# Altium schematic sheet EsquematicoCaneca.SchDoc
size A4; SheetNumber: 1; SheetTotal: 1
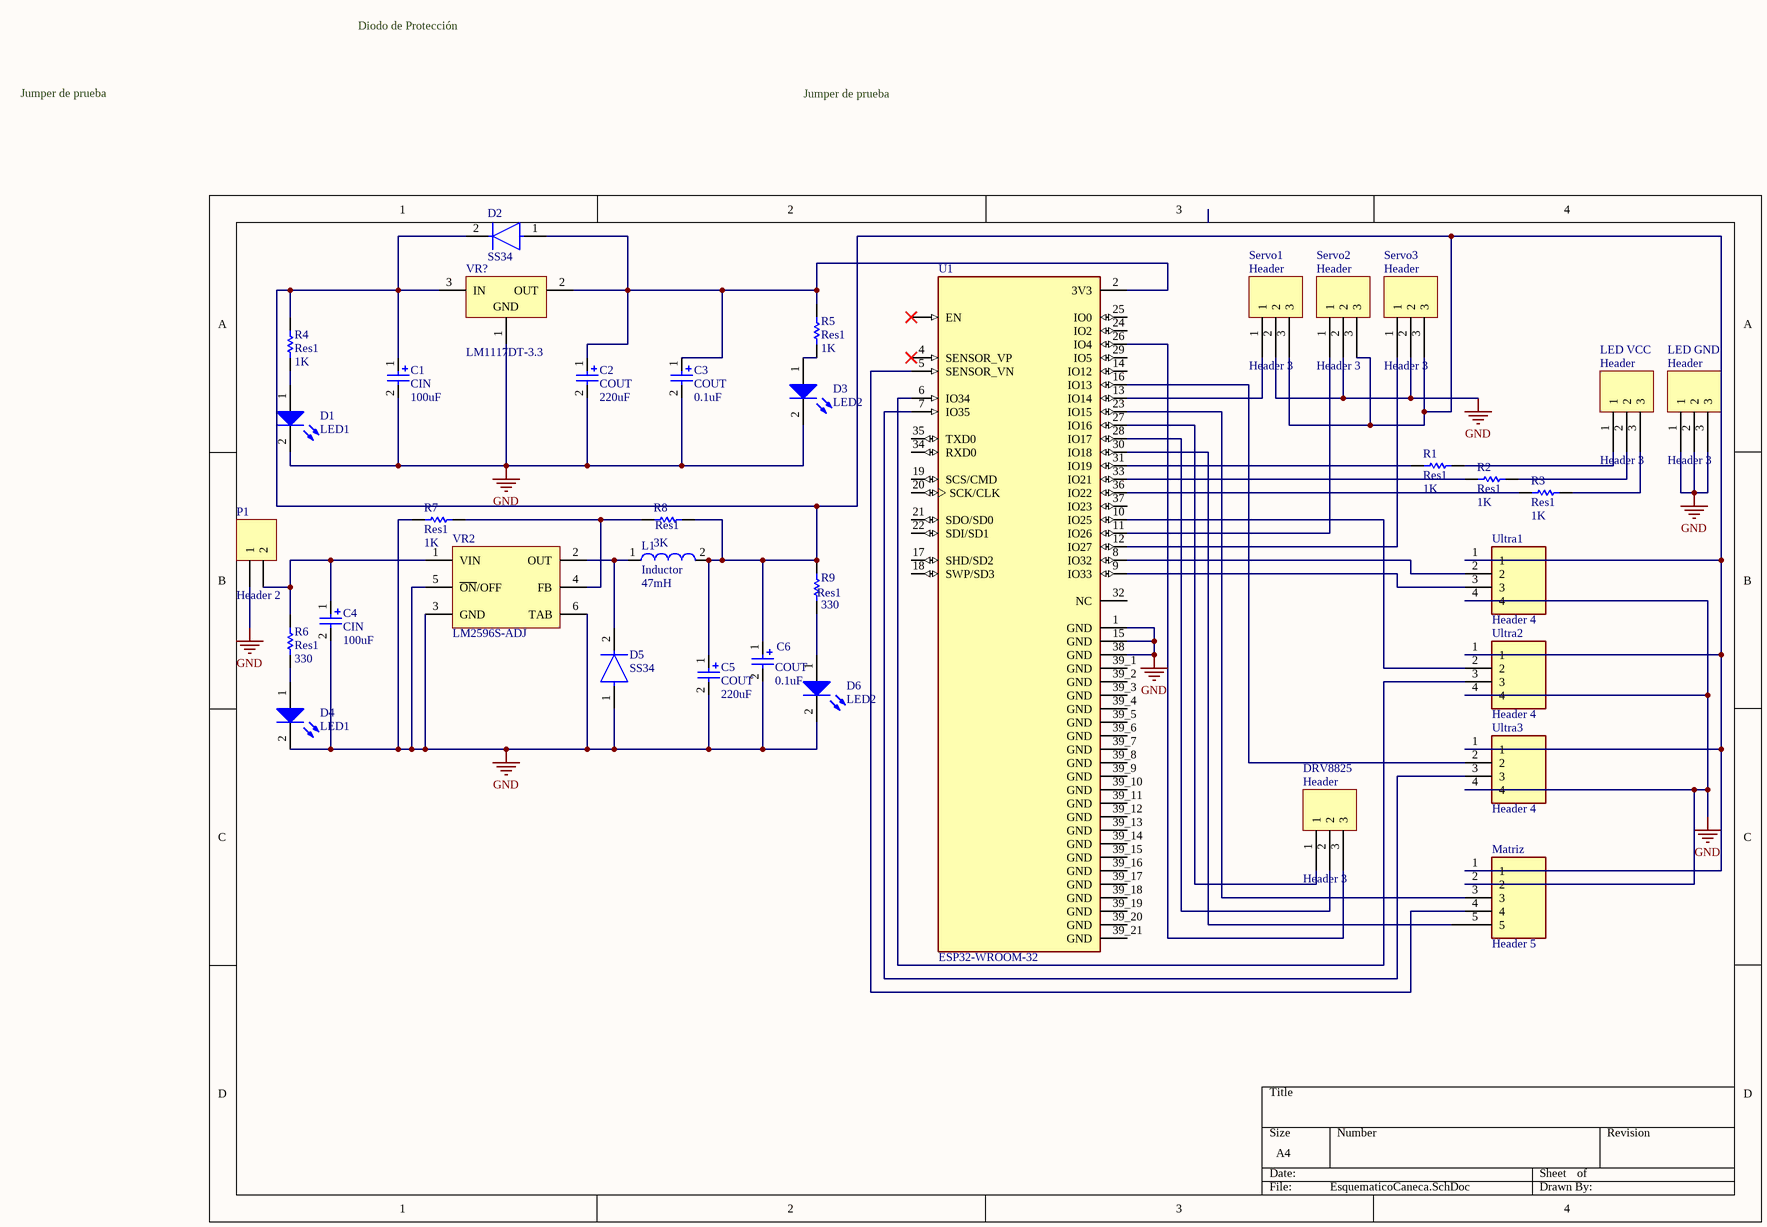
[diagram p0: EsquematicoCaneca.SchDoc]

## Parts
C1  CIN  value 100uF  [CAPACITOR ALUMINUM]
C2  COUT  value 220uF  [CAPACITOR ALUMINUM]
C3  COUT  value 0.1uF  [CC1206]
C4  CIN  value 100uF  [CAPACITOR ALUMINUM]
C5  COUT  value 220uF  [CAPACITOR ALUMINUM]
C6  COUT  value 0.1uF  [CC1206]
D1  LED1  [LED 0805]
D2  SS34  [SS34 DIODE]
D3  LED2  [LED 0805]
D4  LED1  [LED 0805]
D5  SS34  [SS34 DIODE]
D6  LED2  [LED 0805]
DRV8825  Header 3  [header 1x3]
L1  Inductor  value 47mH  [INDUCTOR]
LED_GND  Header 3  [header 1x3]
LED_VCC  Header 3  [header 1x3]
Matriz  Header 5  [HEADER 1X4]
P1  Header 2  [Header 2p - duplicate]
R1  Res1  value 1K  [Resitor]
R2  Res1  value 1K  [Resitor]
R3  Res1  value 1K  [Resitor]
R4  Res1  value 1K  [RESISTOR 1206]
R5  Res1  value 1K  [RESISTOR 1206]
R6  Res1  value 330  [RESISTOR 1206]
R7  Res1  value 1K  [RESISTOR 1206]
R8  Res1  value 3K  [RESISTOR 1206]
R9  Res1  value 330  [RESISTOR 1206]
Servo1  Header 3  [header 1x3]
Servo2  Header 3  [header 1x3]
Servo3  Header 3  [header 1x3]
U1  ESP32-WROOM-32  [MODULE_ESP32-WROOM-32]
Ultra1  Header 4  [HEADER 1X4]
Ultra2  Header 4  [HEADER 1X4]
Ultra3  Header 4  [HEADER 1X4]
VR2  LM2596S-ADJ  [lm2596S]
VR?  LM1117DT-3.3  [LM1117DT-3.3]

## Nets
GND: C1.2 C2.2 C3.2 C4.2 C5.2 C6.2 D1.2(K) D3.2(K) D4.2(K) D5.1(A) D6.2(K) LED_GND.1 LED_GND.2 LED_GND.3 Matriz.2 P1.1 R7.1 Servo1.2 Servo2.2 Servo3.2 U1.1(GND) U1.15(GND) U1.38(GND) Ultra1.4 Ultra2.4 Ultra3.4 VR2.3(GND) VR2.5(~{ON}/OFF) VR2.6(TAB) VR?.1(GND)
NetC1_1: C1.1 C5.1 C6.1 D2.2(C) L1.2 Matriz.1 R4.2 R8.2 R9.2 Servo1.3 Servo2.3 Servo3.3 Ultra1.1 Ultra2.1 Ultra3.1 VR?.3(IN)
NetC2_1: C2.1 C3.1 D2.1(A) R5.2 U1.2(3V3) VR?.2(OUT)
NetC4_1: C4.1 P1.2 R6.2 VR2.1(VIN)
NetD1_1: D1.1(A) R4.1
NetD3_1: D3.1(A) R5.1
NetD4_1: D4.1(A) R6.1
NetD5_2: D5.2(C) L1.1 VR2.2(OUT)
NetD6_1: D6.1(A) R9.1
NetDRV8825_1: DRV8825.1 U1.27(IO16)
NetDRV8825_2: DRV8825.2 U1.28(IO17)
NetDRV8825_3: DRV8825.3 U1.26(IO4)
NetLED_VCC_1: LED_VCC.1 R1.2
NetLED_VCC_2: LED_VCC.2 R2.2
NetLED_VCC_3: LED_VCC.3 R3.2
NetMatriz_3: Matriz.3 U1.23(IO15)
NetMatriz_4: Matriz.4 U1.5(SENSOR_VN)
NetMatriz_5: Matriz.5 U1.30(IO18)
NetR1_1: R1.1 U1.31(IO19)
NetR2_1: R2.1 U1.33(IO21)
NetR3_1: R3.1 U1.36(IO22)
NetR7_2: R7.2 R8.1 VR2.4(FB)
NetServo1_1: Servo1.1 U1.13(IO14)
NetServo2_1: Servo2.1 U1.11(IO26)
NetServo3_1: Servo3.1 U1.12(IO27)
NetU1_6: U1.6(IO34) Ultra2.3
NetU1_7: U1.7(IO35) Ultra3.3
NetU1_8: U1.8(IO32) Ultra1.2
NetU1_9: U1.9(IO33) Ultra1.3
NetU1_10: U1.10(IO25) Ultra2.2
NetU1_16: U1.16(IO13) Ultra3.2

Not connected (* = marked no-connect by the designer): U1 3(EN)* 4(SENSOR_VP)* 14(IO12) 17(SHD/SD2) 18(SWP/SD3) 19(SCS/CMD) 20(SCK/CLK) 21(SDO/SD0) 22(SDI/SD1) 24(IO2) 25(IO0) 29(IO5) 32(NC) 34(RXD0) 35(TXD0) 37(IO23) 39_1(GND) 39_2(GND) 39_3(GND) 39_4(GND) 39_5(GND) 39_6(GND) 39_7(GND) 39_8(GND) 39_9(GND) 39_10(GND) 39_11(GND) 39_12(GND) 39_13(GND) 39_14(GND) 39_15(GND) 39_16(GND) 39_17(GND) 39_18(GND) 39_19(GND) 39_20(GND) 39_21(GND)

## Notes on the sheet
- Diodo de Protección
- Jumper de prueba
- (in symbol Header 3) Header

## Library data of the parts
C1 C4 = Cap Pol1: Polarized Capacitor (Radial); Published: 8-Jun-2000; LatestRevisionDate: 17-Jul-2002; LatestRevisionNote: Re-released for DXP Platform.; PackageReference: RB7.6-15; Publisher: Altium Limited; PackageDescription: Polarized Capacitor (Radial); 2 Leads
C2 C5 = Cap Pol1_1: Polarized Capacitor (Radial); Published: 8-Jun-2000; LatestRevisionDate: 17-Jul-2002; LatestRevisionNote: Re-released for DXP Platform.; PackageReference: RB7.6-15; Publisher: Altium Limited; PackageDescription: Polarized Capacitor (Radial); 2 Leads
C3 C6 = Cap Pol1_2: Polarized Capacitor (Radial); Published: 8-Jun-2000; LatestRevisionDate: 17-Jul-2002; LatestRevisionNote: Re-released for DXP Platform.; PackageReference: RB7.6-15; Publisher: Altium Limited; PackageDescription: Polarized Capacitor (Radial); 2 Leads
D1 D3 D6 = LED0: Typical INFRARED GaAs LED; Published: 8-Jun-2000; LatestRevisionDate: 08-Jul-2005; LatestRevisionNote: Mech Layer 1 removed.; PackageReference: LED-0; Publisher: Altium Limited; PackageDescription: LED; 2 Leads
D2 D5 = CMP-02539-000012-1: DIODE SCHOTTKY 40V 3A DO214AB; Manufacturer: Vishay; Manufacturer Part Number: SS34-E3/57T; Max Junction Temp: +150°C; Peak Reverse Current: 0.5mA; Max Surge Forward Current: 100A; Standoff Height: 0mm; ComponentLink2Description: Datasheet; Device Class L3: Schottky Diodes; Height: 2.62mm; Max Repetitive Reverse Voltage: 40V; Lead Free: Yes; Package: 95402; Temperature Range High: +150°C; ComponentLink2URL: http://www.vishay.com/docs/88751/ss32.pdf; Temperature: -55°C to +150°C; Footprint Url: http://www.vishay.com/docs/95402/smc.pdf; Automotive: No; Forward Current: 3A; Category: Diode; RoHS: TRUE; Device Class L2: Diodes; Mouser Description: Schottky Diodes & Rectifiers 3.0 Amp 40 Volt; Octopart: https://octopart.com/ss34-e3%2F57t-vishay-39552907; Temperature Range Low: -55°C; Device Class L1: Discrete Semiconductors; Digikey Description: DIODE SCHOTTKY 40V 3A DO214AB
D4 = LED0_1: Typical INFRARED GaAs LED; Published: 8-Jun-2000; LatestRevisionDate: 08-Jul-2005; LatestRevisionNote: Mech Layer 1 removed.; PackageReference: LED-0; Publisher: Altium Limited; PackageDescription: LED; 2 Leads
L1 = Inductor: Code_IEC: 1005; Published: 8-Jun-2000; LatestRevisionDate: 29-May-2009; LatestRevisionNote: IPC-7351 Footprint Added.; PackageReference: 0402-A; Publisher: Altium Limited; PackageDescription: Chip Inductor; Code_JEITA: 0402
Matriz = Header 5: MP: 640453-4; MF: {'manufacturer': 'TE Connectivity'}; Price: None; Package: None; Availability: Unavailable; Value: *
P1 = TERMINAL BLOCK: Header, 2-Pin; LatestRevisionDate: 17-Jul-2002; LatestRevisionNote: Re-released for DXP Platform.; Publisher: Altium Limited
R1-R5 R7 = Res1: Resistor; Published: 8-Jun-2000; LatestRevisionDate: 17-Jul-2002; LatestRevisionNote: Re-released for DXP Platform.; PackageReference: AXIAL-0.3; Publisher: Altium Limited; PackageDescription: Axial Device, Thru-Hole; 2 Leads; 0.3 in Pin Spacing
R6 R9 = Res1_2: Resistor; Published: 8-Jun-2000; LatestRevisionDate: 17-Jul-2002; LatestRevisionNote: Re-released for DXP Platform.; PackageReference: AXIAL-0.3; Publisher: Altium Limited; PackageDescription: Axial Device, Thru-Hole; 2 Leads; 0.3 in Pin Spacing
R8 = Res1_1: Resistor; Published: 8-Jun-2000; LatestRevisionDate: 17-Jul-2002; LatestRevisionNote: Re-released for DXP Platform.; PackageReference: AXIAL-0.3; Publisher: Altium Limited; PackageDescription: Axial Device, Thru-Hole; 2 Leads; 0.3 in Pin Spacing
U1 = ESP32-WROOM-32: Bluetooth, WiFi 802.11b/g/n, Bluetooth v4.2 +EDR, Class 1, 2 and 3 Transceiver Module 2.4GHz ~ 2.5GHz Antenna Not Included, U.FL Surface Mount; MF: Espressif Systems; Price: None; Availability: In Stock; MP: ESP32-WROOM-32; Package: Module Espressif Systems; SnapEDA_Link: https://www.snapeda.com/parts/ESP32-WROOM-32/Espressif+Systems/view-part/?ref=snap; Check_prices: https://www.snapeda.com/parts/ESP32-WROOM-32/Espressif+Systems/view-part/?ref=eda; Value: *; Purchase-URL: https://pricing.snapeda.com/search/part/ESP32-WROOM-32/?ref=eda
Ultra1-Ultra3 = Header 4: MP: 640453-4; MF: {'manufacturer': 'TE Connectivity'}; Price: None; Package: None; Availability: Unavailable; Value: *
VR2 = LM2596S-ADJ: SIMPLE SWITCHER® Power Converter 150 KHz 3A Step-Down Voltage Regulator, 5-pin TO-263; Manufacturer: National Semiconductor; Manufacturer: TI National Semiconductor; Manufacturer Part Number: LM2596SADJ; PackageTopMarking: NSUZXYTTE#*LM2596S*-ADJ P+; PowerWise: N; ComponentLink1Description: LM2596 Datasheet; RoHS: N; PackageVersion: revD, Apr-2005; DatasheetVersion: May-2002; ComponentLink2Description: LM2596 Web Page; ComponentLink2URL: http://www.national.com/pf/LM/LM2596.html; RevisionNote: Component URLs added; PackageDescription: TO-263, Molded, .400 x .390 x .180in, 5 Lead, .067in Pitch, Surface Mount; ComponentLink3Description: TS5B Package Page; ComponentLink1URL: http://www.national.com/ds/LM/LM2596.pdf; PackageReference: TS5B; Code_JEDEC: MO-169-AB; PinCount: 5; ComponentLink3URL: http://www.national.com/packaging/folders/ts5b.html; CompType: Switcher
VR? = LM1117DT-3.3: 800mA Low-Dropout Linear Regulator, 3-pin TO-252; Manufacturer: National Semiconductor; Manufacturer: TI National Semiconductor; CompType: LDO IC; PowerWise: N; PackageTopMarking: NSUZXYTT*LM1117*DT-3.3; RevisionNote: Component URLs added; ComponentLink1URL: http://www.national.com/ds/LM/LM1117.pdf; ComponentLink2URL: http://www.national.com/pf/LM/LM1117.html; ComponentLink2Description: LM1117 Web Page; ComponentLink3URL: http://www.national.com/packaging/folders/td03b.html; DatasheetVersion: Apr-2006; PackageDescription: TO252, Molded, Jedec, 6.8 x 6.10 x 2.30mm Body, 3 Lead, 2.28mm Pitch, Surface Mount; Code_JEDEC: TO-252-AA; PackageReference: TD03B; RoHS: N; ComponentLink3Description: TD03B Package Page; ComponentLink1Description: LM1117 Datasheet; PackageVersion: revD, Feb-2009; PinCount: 3; Manufacturer Part Number: LM1117DT-3.3